# EAGLE schematic mainboard (EAGLE 6.0)
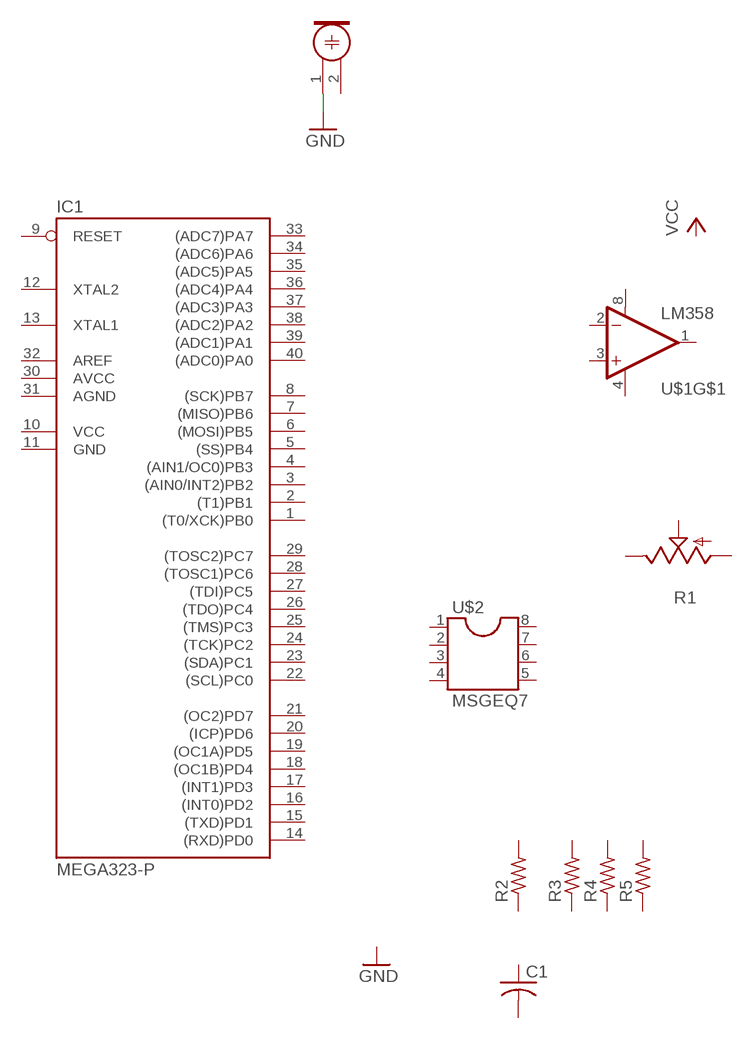
[diagram p0: schematic, sheet 1]

## Parts
C1  C-US050-025X075  [C050-025X075]
IC1  MEGA323-P  [DIL40]
M1  ELECTRET_MICROPHON-F6035AP  [F6035AP]
R1  TRIM_US-LI10  [LI10]
R2  R-US_0207/10  [0207/10]
R3  R-US_0207/10  [0207/10]
R4  R-US_0207/10  [0207/10]
R5  R-US_0207/10  [0207/10]
U$1  LM358  [DIP08]
U$2  MSGEQ7  [SOCKET-08]

## Nets
GND: M1.1
Unconnected: C1.1 C1.2 IC1.1((T0/XCK)PB0) IC1.2((T1)PB1) IC1.3((AIN0/INT2)PB2) IC1.4((AIN1/OC0)PB3) IC1.5((SS)PB4) IC1.6((MOSI)PB5) IC1.7((MISO)PB6) IC1.8((SCK)PB7) IC1.9(RESET) IC1.12(XTAL2) IC1.13(XTAL1) IC1.14((RXD)PD0) IC1.15((TXD)PD1) IC1.16((INT0)PD2) IC1.17((INT1)PD3) IC1.18((OC1B)PD4) IC1.19((OC1A)PD5) IC1.20((ICP)PD6) IC1.21((OC2)PD7) IC1.22((SCL)PC0) IC1.23((SDA)PC1) IC1.24((TCK)PC2) IC1.25((TMS)PC3) IC1.26((TDO)PC4) IC1.27((TDI)PC5) IC1.28((TOSC1)PC6) IC1.29((TOSC2)PC7) IC1.32(AREF) IC1.33((ADC7)PA7) IC1.34((ADC6)PA6) IC1.35((ADC5)PA5) IC1.36((ADC4)PA4) IC1.37((ADC3)PA3) IC1.38((ADC2)PA2) IC1.39((ADC1)PA1) IC1.40((ADC0)PA0) M1.2 R1.A R1.E R1.S R2.1 R2.2 R3.1 R3.2 R4.1 R4.2 R5.1 R5.2 U$1.1(OUT) U$1.2(-IN) U$1.3(+IN) U$1.5(+IN) U$1.6(-IN) U$1.7(OUT) U$2.1 U$2.2 U$2.3 U$2.4 U$2.5 U$2.6 U$2.7 U$2.8

## Power pins joined to a net without a drawn wire
AGND: IC1.31(AGND)
AVCC: IC1.30(AVCC)
GND: IC1.11(GND)
V+: U$1.8(V+)
V-: U$1.4(V-)
VCC: IC1.10(VCC)

## Library data of the parts
C1 = resistor:C-US: CAPACITOR, American symbol
IC1 = atmel:MEGA323-P: MICROCONTROLLER 32 Kbytes FLASH 2 Kbytes SRAM 1 Kbytes EEPROM USART 8-channel 10 bit ADC Source: avr.lbr; OC_FARNELL: unknown; OC_NEWARK: unknown
M1 = microphon:ELECTRET_MICROPHON-: Electret Condenser Microphone
R1 = pot:TRIM_US-: POTENTIOMETER
R2-R5 = resistor:R-US_: RESISTOR, American symbol
U$1 = SparkFun:LM358
U$2 = RobThePyro:MSGEQ7